# Altium schematic sheet Main.SchDoc: Main
size A3; DrawnBy: Mogens Groth Nicolaisen; DocumentNumber: 2; SheetNumber: 2; SheetTotal: 7
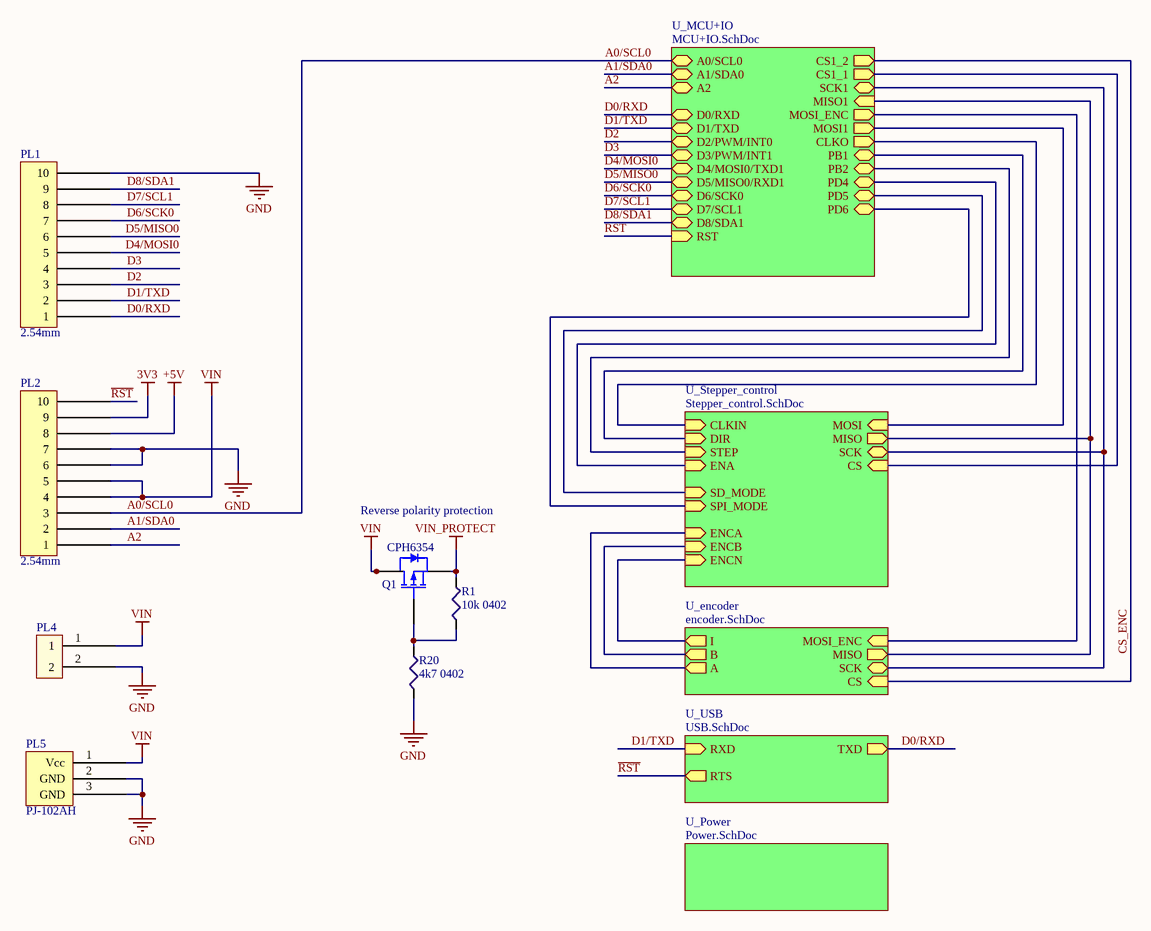
[diagram p0: Main.SchDoc]

## Parts
PL1  2.54mm  [10-pin female 2.54mm]
PL2  2.54mm  [10-pin female 2.54mm]
PL4  2pin Terminal block 5.08mm  [5mm header]  (value not drawn)
PL5  PJ-102AH  [PJ-102AH]
Q1  CPH6354  [SOT95P280X95-6N]
R1  10k 0402  [RES_0402]
R20  4k7 0402  [RES_0402]

## Sub-sheets
U_encoder = encoder.SchDoc: MISO (out), MOSI_ENC (in), SCK (bidir), CS (in), A (out), B (out), I (out)
U_MCU+IO = MCU+IO.SchDoc: A0/SCL0 (bidir), A1/SDA0 (bidir), A2 (bidir), MOSI_ENC (out), D1/TXD (bidir), D0/RXD (bidir), PB2 (bidir), D4/MOSI0/TXD1 (bidir), D5/MISO0/RXD1 (bidir), D6/SCK0 (bidir), SCK1 (bidir), MISO1 (in), MOSI1 (out), CS1_1 (out), CLKO (out), D8/SDA1 (bidir), D7/SCL1 (bidir), D3/PWM/INT1 (bidir), D2/PWM/INT0 (bidir), PD5 (bidir), PD6 (bidir), PD4 (bidir), PB1 (bidir), CS1_2 (out), RST (in)
U_Power = Power.SchDoc: no entries
U_Stepper_control = Stepper_control.SchDoc: STEP (in), DIR (in), CS (in), SCK (bidir), MOSI (in), MISO (out), ENCN (in), ENCA (in), ENCB (in), SPI_MODE (in), SD_MODE (in), ENA (in), CLKIN (in)
U_USB = USB.SchDoc: RXD (in), TXD (out), RTS (out)

## Nets
3V3: PL2.9
+5V: PL2.8
GND: PL1.10 PL2.6 PL2.7 PL4.2 PL5.2(GND) PL5.3(GND) R20.1
VIN: PL2.4 PL2.5 PL4.1 PL5.1(Vcc) Q1.1(DRAIN) Q1.2(DRAIN) Q1.5(DRAIN) Q1.6(DRAIN)
VIN_PROTECT: Q1.4(SOURCE) R1.2
~{RST}: PL2.10 ; sheet U_USB/RTS, sheet U_MCU+IO/RST
A0/SCL0: PL2.3 ; sheet U_MCU+IO/A0/SCL0
A1/SDA0: PL2.2 ; sheet U_MCU+IO/A1/SDA0
A2: PL2.1 ; sheet U_MCU+IO/A2
CS_ENC: sheet U_encoder/CS, sheet U_MCU+IO/CS1_2
D0/RXD: PL1.1 ; sheet U_USB/TXD, sheet U_MCU+IO/D0/RXD
D1/TXD: PL1.2 ; sheet U_USB/RXD, sheet U_MCU+IO/D1/TXD
D2: PL1.3 ; sheet U_MCU+IO/D2/PWM/INT0
D3: PL1.4 ; sheet U_MCU+IO/D3/PWM/INT1
D4/MOSI0: PL1.5 ; sheet U_MCU+IO/D4/MOSI0/TXD1
D5/MISO0: PL1.6 ; sheet U_MCU+IO/D5/MISO0/RXD1
D6/SCK0: PL1.7 ; sheet U_MCU+IO/D6/SCK0
D7/SCL1: PL1.8 ; sheet U_MCU+IO/D7/SCL1
D8/SDA1: PL1.9 ; sheet U_MCU+IO/D8/SDA1
NetQ1_3: Q1.3(GATE) R1.1 R20.2
(unnamed): sheet U_encoder/MISO, sheet U_Stepper_control/MISO, sheet U_MCU+IO/MISO1
(unnamed): sheet U_encoder/MOSI_ENC, sheet U_MCU+IO/MOSI_ENC
(unnamed): sheet U_encoder/SCK, sheet U_Stepper_control/SCK, sheet U_MCU+IO/SCK1
(unnamed): sheet U_encoder/A, sheet U_Stepper_control/ENCA
(unnamed): sheet U_encoder/B, sheet U_Stepper_control/ENCB
(unnamed): sheet U_encoder/I, sheet U_Stepper_control/ENCN
(unnamed): sheet U_Stepper_control/STEP, sheet U_MCU+IO/PB2
(unnamed): sheet U_Stepper_control/DIR, sheet U_MCU+IO/PB1
(unnamed): sheet U_Stepper_control/CS, sheet U_MCU+IO/CS1_1
(unnamed): sheet U_Stepper_control/MOSI, sheet U_MCU+IO/MOSI1
(unnamed): sheet U_Stepper_control/SPI_MODE, sheet U_MCU+IO/PD6
(unnamed): sheet U_Stepper_control/SD_MODE, sheet U_MCU+IO/PD5
(unnamed): sheet U_Stepper_control/ENA, sheet U_MCU+IO/PD4
(unnamed): sheet U_Stepper_control/CLKIN, sheet U_MCU+IO/CLKO

## Notes on the sheet
- Reverse polarity protection
- ON Development
- Title:
- Size:
- A3
- Drawn By:
- Date:
- Sheet
- of
- Revision:

## Library data of the parts
PL1 PL2 = CMP-003-0004-2: Pin header 10-pin 2.54mm female; Mfg. Part Number: DS1023-1*10S21
PL4 = CMP-003-0002-2: PCB terminal block, angled 90°; 5mm, 2-way, 1.5mm2; Mfg. Part Number: DG301-5.0-02P-11-00A(H)
PL5 = CMP-003-0001-3: CONN PWR JACK 2X5.5MM SOLDER; Mfg. Part Number: PJ-102AH
Q1 = CMP-014-0006-2: MOSFET P-CH 60V 4A CPH6; Mfg. Part Number: CPH6354-TL-W
R1 = CMP-001-0019-3: RES SMD 10K OHM 1% 1/16W 0402; Mfg. Part Number: RMCF0402FT10K0; Case/Package: 0402; Power: 1/16 W; Tolerance: 1 %; Value: 10k
R20 = CMP-001-0029-3: RES SMD 4.7K OHM 1% 1/16W 0402; Mfg. Part Number: RC1005F472CS; Tolerance: 1; Case/Package: 0402; Power: 1/16W; Value: 4k7